# Altium schematic sheet uMultimeter_SWD_Sch.SchDoc: MicroMultimeter - SWD
size 127 x 101 mm; Author: Hom; CompanyName: KitSprout; DrawnBy: Hom; Engineer: Hom; Organization: KitSprout; Revision: B; SheetNumber: 1; SheetTotal: 1; License: CC BY-SA 4.0; Version: 2.0; LibVersion: 2.1; PageSetup: Record=PageOptions|CenterHorizontal=True|CenterVertical=True|PrintScale=1.00|XCorrection=1.00|YCorrection=1.00|PrintKind=0|BorderSize=5000000|LeftOffset=0|BottomOffset=0|Orientation=2|PaperLength=1000|PaperWidth=1000|Scale=100|PaperSource=7|PrintQuality=-3|MediaType=1|DitherType=10|PrintScaleMode=0|PaperKind=A4|PaperIndex=9
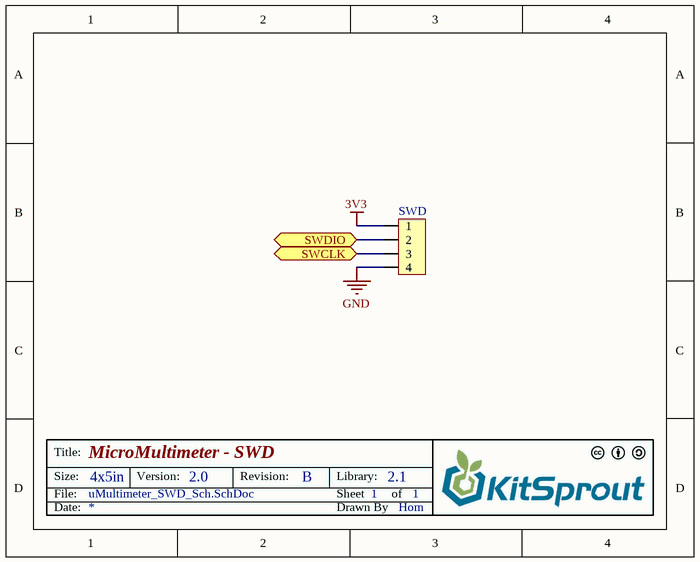
[diagram p0: uMultimeter_SWD_Sch.SchDoc]

## Parts
SWD  HDR1x4_1.27  [HDR1X4_1.27_180]  (value not drawn)

## Ports
SWCLK, SWDIO

## Nets
3V3: SWD.1
GND: SWD.4
SWCLK: SWD.3 ; port SWCLK
SWDIO: SWD.2 ; port SWDIO

## Notes on the sheet
- Title:
- Size:
- Date:
- File:
- 4x5in
- Version:
- Revision:
- Sheet
- Drawn By
- Library:
- of

## Library data of the parts
SWD = HDR1x4_1.27: Header